# Altium schematic sheet eGAN-FET-module_Logic.SchDoc
size 594 x 420 mm; SheetNumber: 3; Format: A2
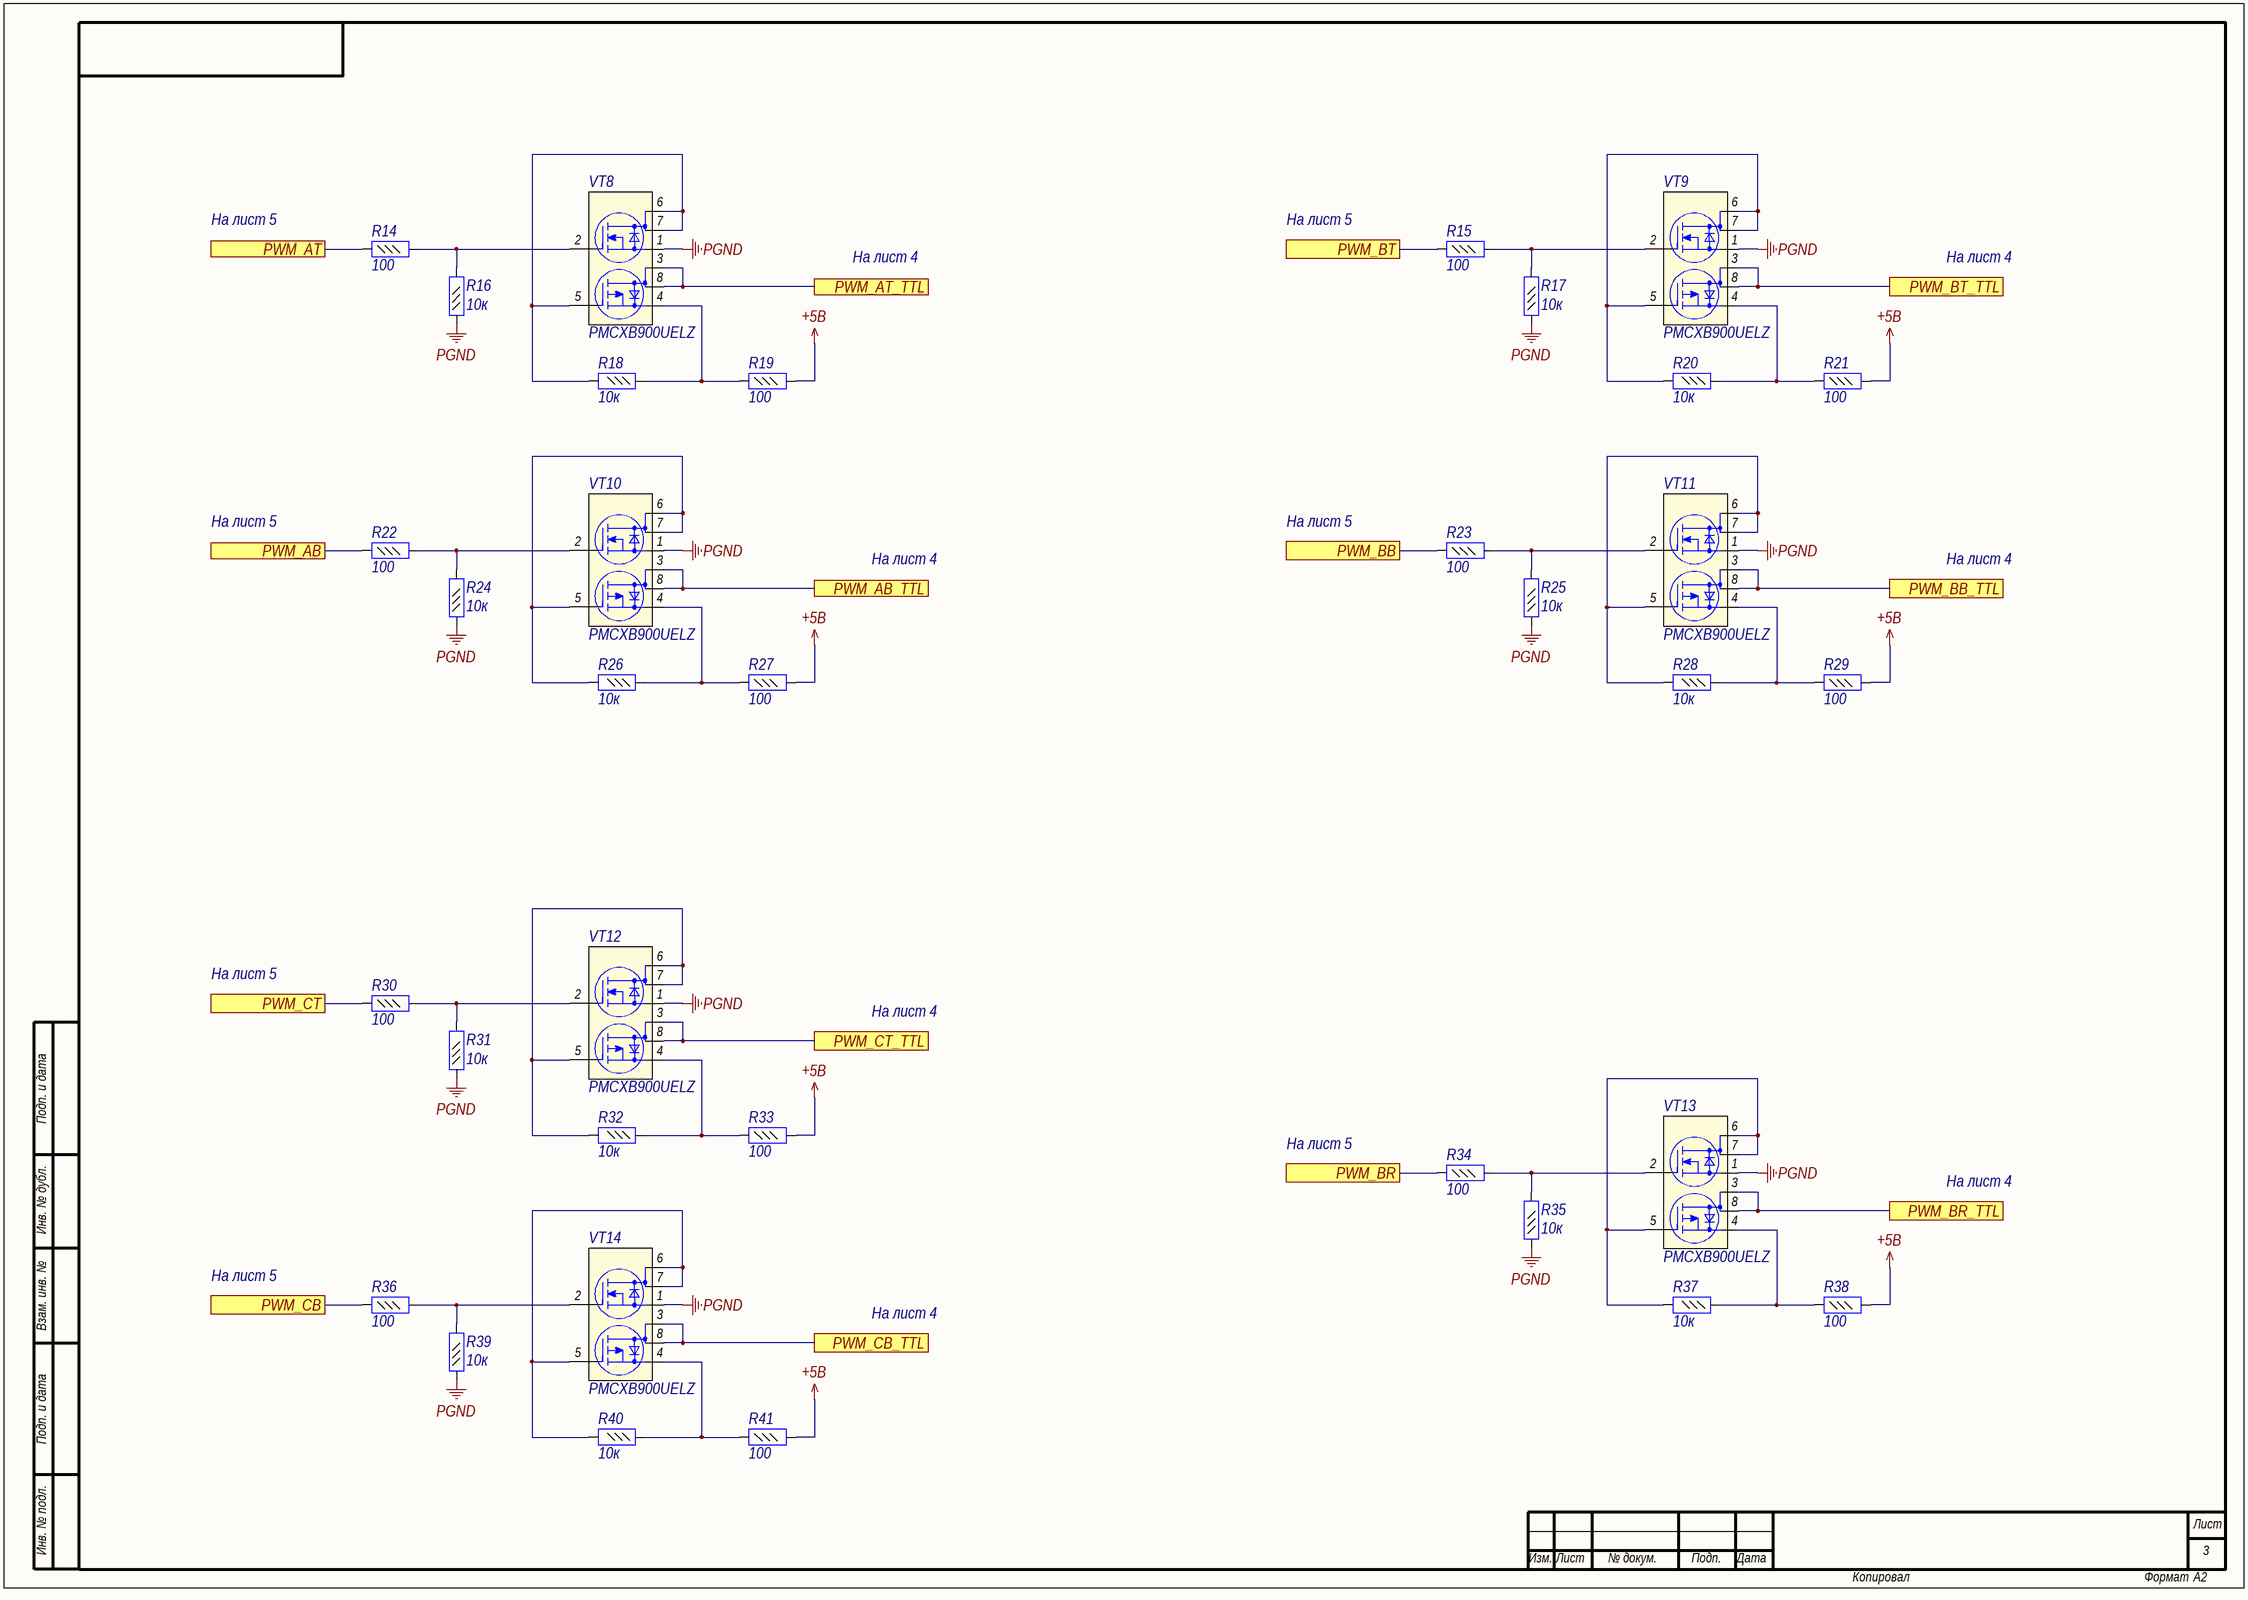
[diagram p0: eGAN-FET-module_Logic.SchDoc]

## Parts
R14  value 100  [R0402]  (hidden comment: Resistor_0,062Вт)
R15  value 100  [R0402]  (hidden comment: Resistor_0,062Вт)
R16  value 10к  [R0402]  (hidden comment: Resistor_0,062Вт)
R17  value 10к  [R0402]  (hidden comment: Resistor_0,062Вт)
R18  value 10к  [R0402]  (hidden comment: Resistor_0,062Вт)
R19  value 100  [R0402]  (hidden comment: Resistor_0,062Вт)
R20  value 10к  [R0402]  (hidden comment: Resistor_0,062Вт)
R21  value 100  [R0402]  (hidden comment: Resistor_0,062Вт)
R22  value 100  [R0402]  (hidden comment: Resistor_0,062Вт)
R23  value 100  [R0402]  (hidden comment: Resistor_0,062Вт)
R24  value 10к  [R0402]  (hidden comment: Resistor_0,062Вт)
R25  value 10к  [R0402]  (hidden comment: Resistor_0,062Вт)
R26  value 10к  [R0402]  (hidden comment: Resistor_0,062Вт)
R27  value 100  [R0402]  (hidden comment: Resistor_0,062Вт)
R28  value 10к  [R0402]  (hidden comment: Resistor_0,062Вт)
R29  value 100  [R0402]  (hidden comment: Resistor_0,062Вт)
R30  value 100  [R0402]  (hidden comment: Resistor_0,062Вт)
R31  value 10к  [R0402]  (hidden comment: Resistor_0,062Вт)
R32  value 10к  [R0402]  (hidden comment: Resistor_0,062Вт)
R33  value 100  [R0402]  (hidden comment: Resistor_0,062Вт)
R34  value 100  [R0402]  (hidden comment: Resistor_0,062Вт)
R35  value 10к  [R0402]  (hidden comment: Resistor_0,062Вт)
R36  value 100  [R0402]  (hidden comment: Resistor_0,062Вт)
R37  value 10к  [R0402]  (hidden comment: Resistor_0,062Вт)
R38  value 100  [R0402]  (hidden comment: Resistor_0,062Вт)
R39  value 10к  [R0402]  (hidden comment: Resistor_0,062Вт)
R40  value 10к  [R0402]  (hidden comment: Resistor_0,062Вт)
R41  value 100  [R0402]  (hidden comment: Resistor_0,062Вт)
VT8  PMCXB900UELZ  [SOT1216]
VT9  PMCXB900UELZ  [SOT1216]
VT10  PMCXB900UELZ  [SOT1216]
VT11  PMCXB900UELZ  [SOT1216]
VT12  PMCXB900UELZ  [SOT1216]
VT13  PMCXB900UELZ  [SOT1216]
VT14  PMCXB900UELZ  [SOT1216]

## Ports
PWM_AB, PWM_AB_TTL, PWM_AT, PWM_AT_TTL, PWM_BB, PWM_BB_TTL, PWM_BR, PWM_BR_TTL, PWM_BT, PWM_BT_TTL, PWM_CB, PWM_CB_TTL, PWM_CT, PWM_CT_TTL

## Nets
+5B: R19.2 R21.2 R27.2 R29.2 R33.2 R38.2 R41.2
PGND: R16.1 R17.1 R24.1 R25.1 R31.1 R35.1 R39.1 VT8.1(S1) VT9.1(S1) VT10.1(S1) VT11.1(S1) VT12.1(S1) VT13.1(S1) VT14.1(S1)
PWM_AB: R22.1 ; port PWM_AB
PWM_AB_TTL: VT10.3(D2) VT10.8(D2) ; port PWM_AB_TTL
PWM_AT: R14.1 ; port PWM_AT
PWM_AT_TTL: VT8.3(D2) VT8.8(D2) ; port PWM_AT_TTL
PWM_BB: R23.1 ; port PWM_BB
PWM_BB_TTL: VT11.3(D2) VT11.8(D2) ; port PWM_BB_TTL
PWM_BR: R34.1 ; port PWM_BR
PWM_BR_TTL: VT13.3(D2) VT13.8(D2) ; port PWM_BR_TTL
PWM_BT: R15.1 ; port PWM_BT
PWM_BT_TTL: VT9.3(D2) VT9.8(D2) ; port PWM_BT_TTL
PWM_CB: R36.1 ; port PWM_CB
PWM_CB_TTL: VT14.3(D2) VT14.8(D2) ; port PWM_CB_TTL
PWM_CT: R30.1 ; port PWM_CT
PWM_CT_TTL: VT12.3(D2) VT12.8(D2) ; port PWM_CT_TTL
NetR14_2: R14.2 R16.2 VT8.2(G1)
NetR15_2: R15.2 R17.2 VT9.2(G1)
NetR18_1: R18.1 R19.1 VT8.4(S2)
NetR18_2: R18.2 VT8.5(G2) VT8.6(D1) VT8.7(D1)
NetR20_1: R20.1 R21.1 VT9.4(S2)
NetR20_2: R20.2 VT9.5(G2) VT9.6(D1) VT9.7(D1)
NetR22_2: R22.2 R24.2 VT10.2(G1)
NetR23_2: R23.2 R25.2 VT11.2(G1)
NetR26_1: R26.1 R27.1 VT10.4(S2)
NetR26_2: R26.2 VT10.5(G2) VT10.6(D1) VT10.7(D1)
NetR28_1: R28.1 R29.1 VT11.4(S2)
NetR28_2: R28.2 VT11.5(G2) VT11.6(D1) VT11.7(D1)
NetR30_2: R30.2 R31.2 VT12.2(G1)
NetR32_1: R32.1 R33.1 VT12.4(S2)
NetR32_2: R32.2 VT12.5(G2) VT12.6(D1) VT12.7(D1)
NetR34_2: R34.2 R35.2 VT13.2(G1)
NetR36_2: R36.2 R39.2 VT14.2(G1)
NetR37_1: R37.1 R38.1 VT13.4(S2)
NetR37_2: R37.2 VT13.5(G2) VT13.6(D1) VT13.7(D1)
NetR40_1: R40.1 R41.1 VT14.4(S2)
NetR40_2: R40.2 VT14.5(G2) VT14.6(D1) VT14.7(D1)

## Notes on the sheet
- На лист 5
- На лист 4
- Подп. и дата
- Инв. № дубл.
- Взам. инв. №
- Инв. № подл.
- Лист
- Изм.
- № докум.
- Подп.
- Дата
- Копировал
- Формат

## Library data of the parts
R14 R15 R19 R21-R23 R27 R29 R30 R33 R34 R36 R38 R41 = res246: Резистор; Manufacture: Yageo; Part Number: RC0402FR-07100RL; id: res246; Accuracy: 0.01; Part Name: Resistor; Power: 0,062Вт
R16-R18 R20 R24-R26 R28 R31 R32 R35 R37 R39 R40 = res294: Резистор; Manufacture: Yageo; Part Number: RC0402FR-0710KL; id: res294; Accuracy: 0,01; Part Name: Resistor; Power: 0,062Вт
VT8-VT14 = mosfert37: Manufacturer: Nexperia; Structure: n-p-channel; V drain-source max: 20B; Gate-to-source voltage: (+-)8B; Continuous drain current: 0,4A; Total gate charge: 0,7nC; Pulsed drain current: 2A; Power dissipation: 0,265W; id: mosfert37; Part Number: PMCXB900UELZ